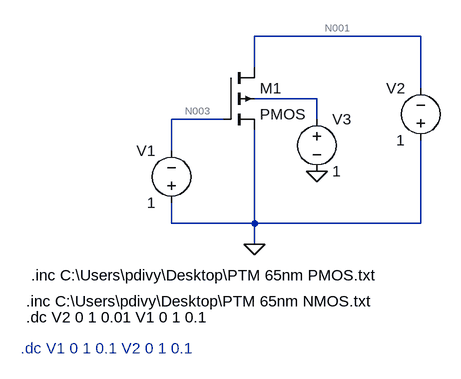
[diagram p0: schematic Draft4.asc]
Draft4.asc, the LTspice schematic file:
Version 4
SHEET 1 880 680
WIRE 496 48 240 48
WIRE 240 96 240 48
WIRE 496 128 496 48
WIRE 336 144 240 144
WIRE 192 176 112 176
WIRE 336 176 336 144
WIRE 112 224 112 176
WIRE 112 336 112 304
WIRE 240 336 240 192
WIRE 240 336 112 336
WIRE 496 336 496 208
WIRE 496 336 240 336
WIRE 240 368 240 336
FLAG 240 368 0
FLAG 336 256 0
SYMBOL pmos4 192 96 R0
SYMATTR InstName M1
SYMBOL voltage 336 160 R0
WINDOW 123 0 0 Left 0
WINDOW 39 0 0 Left 0
SYMATTR InstName V3
SYMATTR Value 1
SYMBOL voltage 496 224 R180
WINDOW 0 24 96 Left 2
WINDOW 3 24 16 Left 2
WINDOW 123 0 0 Left 0
WINDOW 39 0 0 Left 0
SYMATTR InstName V2
SYMATTR Value 1
SYMBOL voltage 112 320 R180
WINDOW 0 24 96 Left 2
WINDOW 3 24 16 Left 2
WINDOW 123 0 0 Left 0
WINDOW 39 0 0 Left 0
SYMATTR InstName V1
SYMATTR Value 1
TEXT -104 416 Left 2 !.inc C:\\Users\\pdivy\\Desktop\\PTM 65nm PMOS.txt
TEXT -112 456 Left 2 !.inc C:\\Users\\pdivy\\Desktop\\PTM 65nm NMOS.txt
TEXT -112 480 Left 2 !.dc V2 0 1 0.01 V1 0 1 0.1
TEXT -120 528 Left 2 ;.dc V1 0 1 0.1 V2 0 1 0.1

The netlist it stands for:
* Draft4.asc
M1 N001 N003 0 N002 PMOS
V3 N002 0 1
V2 0 N001 1
V1 0 N003 1
.model NMOS NMOS
.model PMOS PMOS
.lib standard.mos
.inc C:\Users\pdivy\Desktop\PTM 65nm PMOS.txt
.inc C:\Users\pdivy\Desktop\PTM 65nm NMOS.txt
.dc V2 0 1 0.01 V1 0 1 0.1
* .dc V1 0 1 0.1 V2 0 1 0.1
.backanno
.end

* Results of the author's LTspice run, read from the files saved beside the schematic
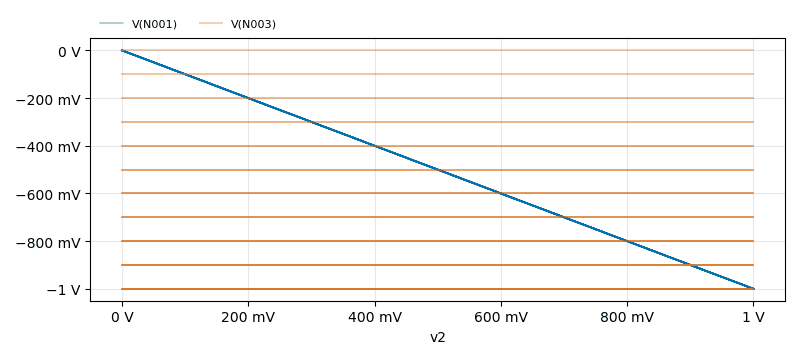
[diagram p1: DC transfer characteristic of Draft4.asc, plotted from the saved traces]
* DC transfer characteristic, 11 runs:
*   V(N001) [v1=0]: 0 V at v2=0 V, -1 V at v2=1 V, min -1 V, max 0 V
*   V(N001) [v1=0.1]: 0 V at v2=0 V, -1 V at v2=1 V, min -1 V, max 0 V
*   V(N001) [v1=0.2]: 0 V at v2=0 V, -1 V at v2=1 V, min -1 V, max 0 V
*   V(N001) [v1=0.3]: 0 V at v2=0 V, -1 V at v2=1 V, min -1 V, max 0 V
*   V(N001) [v1=0.4]: 0 V at v2=0 V, -1 V at v2=1 V, min -1 V, max 0 V
*   V(N001) [v1=0.5]: 0 V at v2=0 V, -1 V at v2=1 V, min -1 V, max 0 V
*   V(N001) [v1=0.6]: 0 V at v2=0 V, -1 V at v2=1 V, min -1 V, max 0 V
*   V(N001) [v1=0.7]: 0 V at v2=0 V, -1 V at v2=1 V, min -1 V, max 0 V
*   V(N003) [v1=0]: 0 V at v2=0 V, 0 V at v2=1 V, min 0 V, max 0 V
*   V(N003) [v1=0.1]: -100 mV at v2=0 V, -100 mV at v2=1 V, min -100 mV, max -100 mV
*   V(N003) [v1=0.2]: -200 mV at v2=0 V, -200 mV at v2=1 V, min -200 mV, max -200 mV
*   V(N003) [v1=0.3]: -300 mV at v2=0 V, -300 mV at v2=1 V, min -300 mV, max -300 mV
*   V(N003) [v1=0.4]: -400 mV at v2=0 V, -400 mV at v2=1 V, min -400 mV, max -400 mV
*   V(N003) [v1=0.5]: -500 mV at v2=0 V, -500 mV at v2=1 V, min -500 mV, max -500 mV
*   V(N003) [v1=0.6]: -600 mV at v2=0 V, -600 mV at v2=1 V, min -600 mV, max -600 mV
*   V(N003) [v1=0.7]: -700 mV at v2=0 V, -700 mV at v2=1 V, min -700 mV, max -700 mV